# Altium schematic sheet Schematic_GPS NEOM8N .schdoc
size 306 x 125 mm
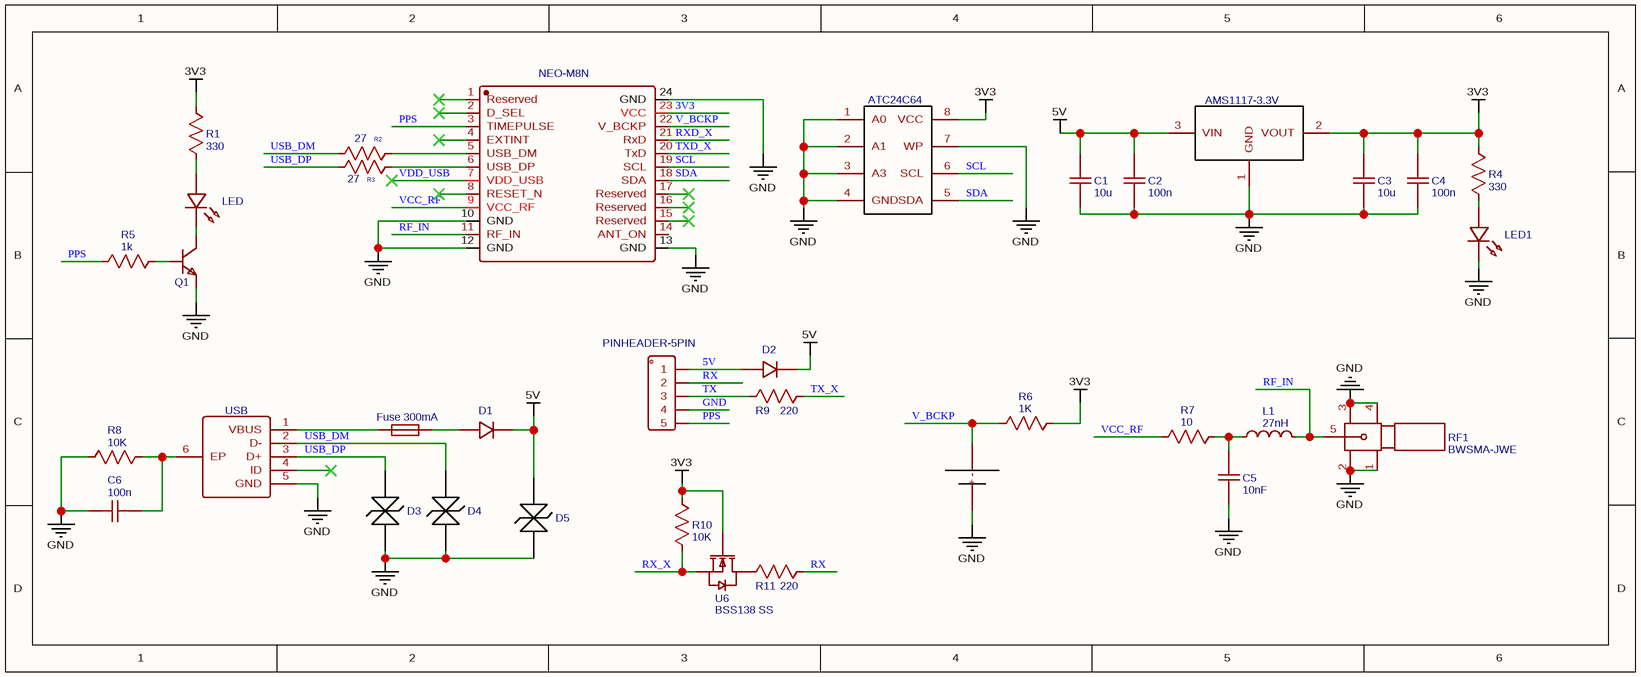
[diagram p0: Schematic_GPS NEOM8N .schdoc]

## Parts
C1  10u  [C0603]
C2  100n  [C0603]
C3  10u  [C0603]
C4  100n  [C0603]
C5  10nF  [RAD-0.1]
C6  100n  [C0603]
CN1  PINHEADER-5PIN  [PINHEADER-PIN5]
D1  1N4007W  [SOD-123_L2.8-W1.8-LS3.7-RD]  (value not drawn)
D2  1N4007W  [SOD-123_L2.8-W1.8-LS3.7-RD]  (value not drawn)
D3  BI_TVS_DIODE  [DO214AA]  (value not drawn)
D4  BI_TVS_DIODE  [DO214AA]  (value not drawn)
D5  BI_TVS_DIODE  [DO214AA]  (value not drawn)
L1  27nH  [L0603]
LED  LED-0603_R  [LED0603_RED]  (value not drawn)
LED1  LED-0603_R  [LED0603_RED]  (value not drawn)
Q1  2N3904(SOT-23)  [SOT-23-3_L2.9-W1.3-P1.90-LS2.4-TR]  (value not drawn)
R1  330  [R0603]
R2  27  [R0603]
R3  27  [R0603]
R4  330  [R0603]
R5  1k  [R0603]
R6  1K  [R0603]
R7  10  [R0603]
R8  10K  [R0603]
R9  220  [R0603]
R10  10K  [R0603]
R11  220  [R0603]
RF1  BWSMA-JWE  [SMA-TH_BWSMA-JWE]
U1  AMS1117-3.3V  [AMS1117]
U2  NEO-M8N  [GPSM-SMD_NEO-M8N]
U3  ATC24C64
U4  Fuse 300mA  [FUSE-SMD_L4.7-W3.4]
U5  AA batery  [AA BATTERY]  (value not drawn)
U6  BSS138 SS  [SOT-23-3_L2.9-W1.4-P1.90-LS2.5-BR]
USB  BTC-MC5S-43  [MICRO-USB-SMD_MICRO-USB-BTC-MC5S-43]  (value not drawn)

## Nets
3V3: C3.2 C4.2 R1.2 R4.2 R6.1 R10.2 U1.2(VOUT) U2.23(VCC) U3.8(VCC) U6.1(G)
5V: C1.2 C2.2 CN1.1 D1.1 D2.1 D2.2 D5.1 U1.3(VIN)
GND: C1.1 C2.1 C3.1 C4.1 C5.1 C6.2 CN1.4 D3.2 D4.2 D5.2 LED1.2 Q1.1(E) R8.1 RF1.1 RF1.2 RF1.3 RF1.4 U1.1(GND) U2.10(GND) U2.12(GND) U2.13(GND) U2.24(GND) U3.1(A0) U3.2(A1) U3.3(A3) U3.4(GND) U3.7(WP) U5.2(-) USB.5(GND)
PPS: CN1.5 R5.1 U2.3(TIMEPULSE)
RF_IN: L1.2 RF1.5 U2.11(RF_IN)
RX: CN1.2 R11.2
RX_X: R10.1 U6.2(S)
RXD_X: U2.21(RxD)
SCL: U2.19(SCL) U3.6(SCL)
SDA: U2.18(SDA) U3.5(SDA)
TX: CN1.3 R9.1
TX_X: R9.2
TXD_X: U2.20(TxD)
USB_DM: D4.1 R2.1 USB.2(D-)
USB_DP: D3.1 R3.1 USB.3(D+)
V_BCKP: R6.2 U2.22(V_BCKP) U5.1(+)
VCC_RF: R7.2 U2.9(VCC_RF)
VDD_USB: U2.7(VDD_USB)
NetC5_2: C5.2 L1.1 R7.1
NetC6_1: C6.1 R8.2 USB.6(EP)
NetD1_2: D1.2 U4.2
NetLED1_1: LED1.1 R4.1
NetLED_1: LED.1 R1.1
NetLED_2: LED.2 Q1.3(C)
NetQ1_2: Q1.2(B) R5.2
NetR2_2: R2.2 U2.5(USB_DM)
NetR3_2: R3.2 U2.6(USB_DP)
NetR11_1: R11.1 U6.3(D)
NetU4_1: U4.1 USB.1(VBUS)

Not connected (* = marked no-connect by the designer): U2 1(Reserved)* 2(D_SEL)* 4(EXTINT)* 8(RESET_N)* 14(ANT_ON) 15(Reserved)* 16(Reserved)* 17(Reserved)*; USB 4(ID)*

## Notes on the sheet
- (in symbol PINHEADER-5PIN) °

## Library data of the parts
C1 C3 = 10u: nameAlias: Value(F); Contributor: LCEDA_Lib; spicePre: C; spiceSymbolName: C_0603_US
C2 C4 C6 = 100n: nameAlias: Value(F); Contributor: LCEDA_Lib; spicePre: C; spiceSymbolName: C_0603_US
C5 = 10nF: Contributor: EasyEDA; Capacitance: 1u; Supplier: YUJING; spicePre: C; spiceSymbolName: Capacitor_US
CN1 = PINHEADER-5PIN: Contributor: Rebilyn De leon; spicePre: C; spiceSymbolName: PINHEADER-5PIN
D1 D2 = 1N4007W: Manufacturer: BLUE ROCKET; Contributor: LCEDA_Lib; Supplier: LCSC; Supplier Part: C328592; Manufacturer Part: 1N4007W; spicePre: D; spiceSymbolName: 1N4007W
D3-D5 = BI_TVS_DIODE: nameAlias: Model; catid: 20; Contributor: Matty87; sim: true; spicePre: X; spiceSymbolName: BI_TVS_DIODE
L1 = 27nH: nameAlias: Value(H); Contributor: LCEDA_Lib; spicePre: L; spiceSymbolName: L0603_US
LED LED1 = LED-0603_R: Manufacturer: EVERLIGHT(台湾亿光); Manufacturer Part: 19-217/R6C-AL1M2VY/3T; Contributor: LCEDA_01; Package Display: No; Supplier Part: C72044; Supplier: LCSC; spicePre: L; spiceSymbolName: LED-0603_R
Q1 = 2N3904(SOT-23): Manufacturer: KEC; Manufacturer Part: 2n3904S-RTK/PS; Contributor: LCEDA_Lib; Supplier: LCSC; Supplier Part: C18536; Paste Type: SOT-23; spicePre: Q; spiceSymbolName: 2N3904(SOT-23)
R1 R4 = 330: nameAlias: Value(Ω); Contributor: LCEDA_Lib; spicePre: R; spiceSymbolName: R_0603_US
R2 R3 = 27: nameAlias: Value(Ω); Contributor: LCEDA_Lib; spicePre: R; spiceSymbolName: R_0603_US
R5 = 1k: nameAlias: Value(Ω); Contributor: LCEDA_Lib; spicePre: R; spiceSymbolName: R_0603_US
R6 = 1K: nameAlias: Value(Ω); Contributor: LCEDA_Lib; spicePre: R; spiceSymbolName: R_0603_US
R7 = 10: nameAlias: Value(Ω); Contributor: LCEDA_Lib; spicePre: R; spiceSymbolName: R_0603_US
R8 R10 = 10K: nameAlias: Value(Ω); Contributor: LCEDA_Lib; spicePre: R; spiceSymbolName: R_0603_US
R9 R11 = 220: nameAlias: Value(Ω); Contributor: LCEDA_Lib; spicePre: R; spiceSymbolName: R_0603_US
RF1 = BWSMA-JWE: Manufacturer: BAT WIRELESS(蝙蝠无线); Contributor: ARNABMACH0; Supplier: LCSC; Supplier Part: C5250065; Manufacturer Part: BWSMA-JWE; JLCPCB Part Class: Extended Part; spicePre: R; spiceSymbolName: BWSMA-JWE
U1 = AMS1117-3.3V: Contributor: kleity; spicePre: U; spiceSymbolName: ADS1117 SOT223
U2 = NEO-M8N: Manufacturer: null; Contributor: LCSC; Supplier: LCSC; Supplier Part: C9900011924; Manufacturer Part: NEO-M8N; JLCPCB Part Class: Extended Part; link: https://lcsc.com/eda_search?q=C9900011924&%26type=1&ref=editor; spicePre: U; spiceSymbolName: NEO-M8N
U3 = ATC24C64: Contributor: gwranarzary; spicePre: U; spiceSymbolName: ATC24C02
U4 = Fuse 300mA: Manufacturer: Littelfuse(美国力特); Manufacturer Part: 1812L110PR; Contributor: LCSC; Supplier: LCSC; Supplier Part: C163516; JLCPCB Part Class: Extended Part; link: https://lcsc.com/eda_search?q=C163516&%26type=1&ref=editor; spicePre: U; spiceSymbolName: 1812L110PR
U5 = AA batery: Contributor: tomaskotian; spicePre: U; spiceSymbolName: AA batery
U6 = BSS138 SS: Manufacturer: CBI(创基); Contributor: lcsc; Supplier: LCSC; Supplier Part: C2919775; Manufacturer Part: BSS138 SS; JLCPCB Part Class: Extended Part; link: https://lcsc.com/eda_search?q=C2919775&%26type=1&ref=editor; spicePre: U; spiceSymbolName: BSS138 SS
USB = BTC-MC5S-43: Manufacturer: DGBZ(东莞博众); Contributor: LCSC; Supplier: LCSC; Supplier Part: C2908217; Manufacturer Part: BTC-MC5S-43; JLCPCB Part Class: Extended Part; link: https://lcsc.com/eda_search?q=C2908217&%26type=1&ref=editor; spicePre: U; spiceSymbolName: BTC-MC5S-43